# Altium schematic sheet 01-100BASET1_PHY.SchDoc
size A3; SheetNumber: 1; SheetTotal: 2
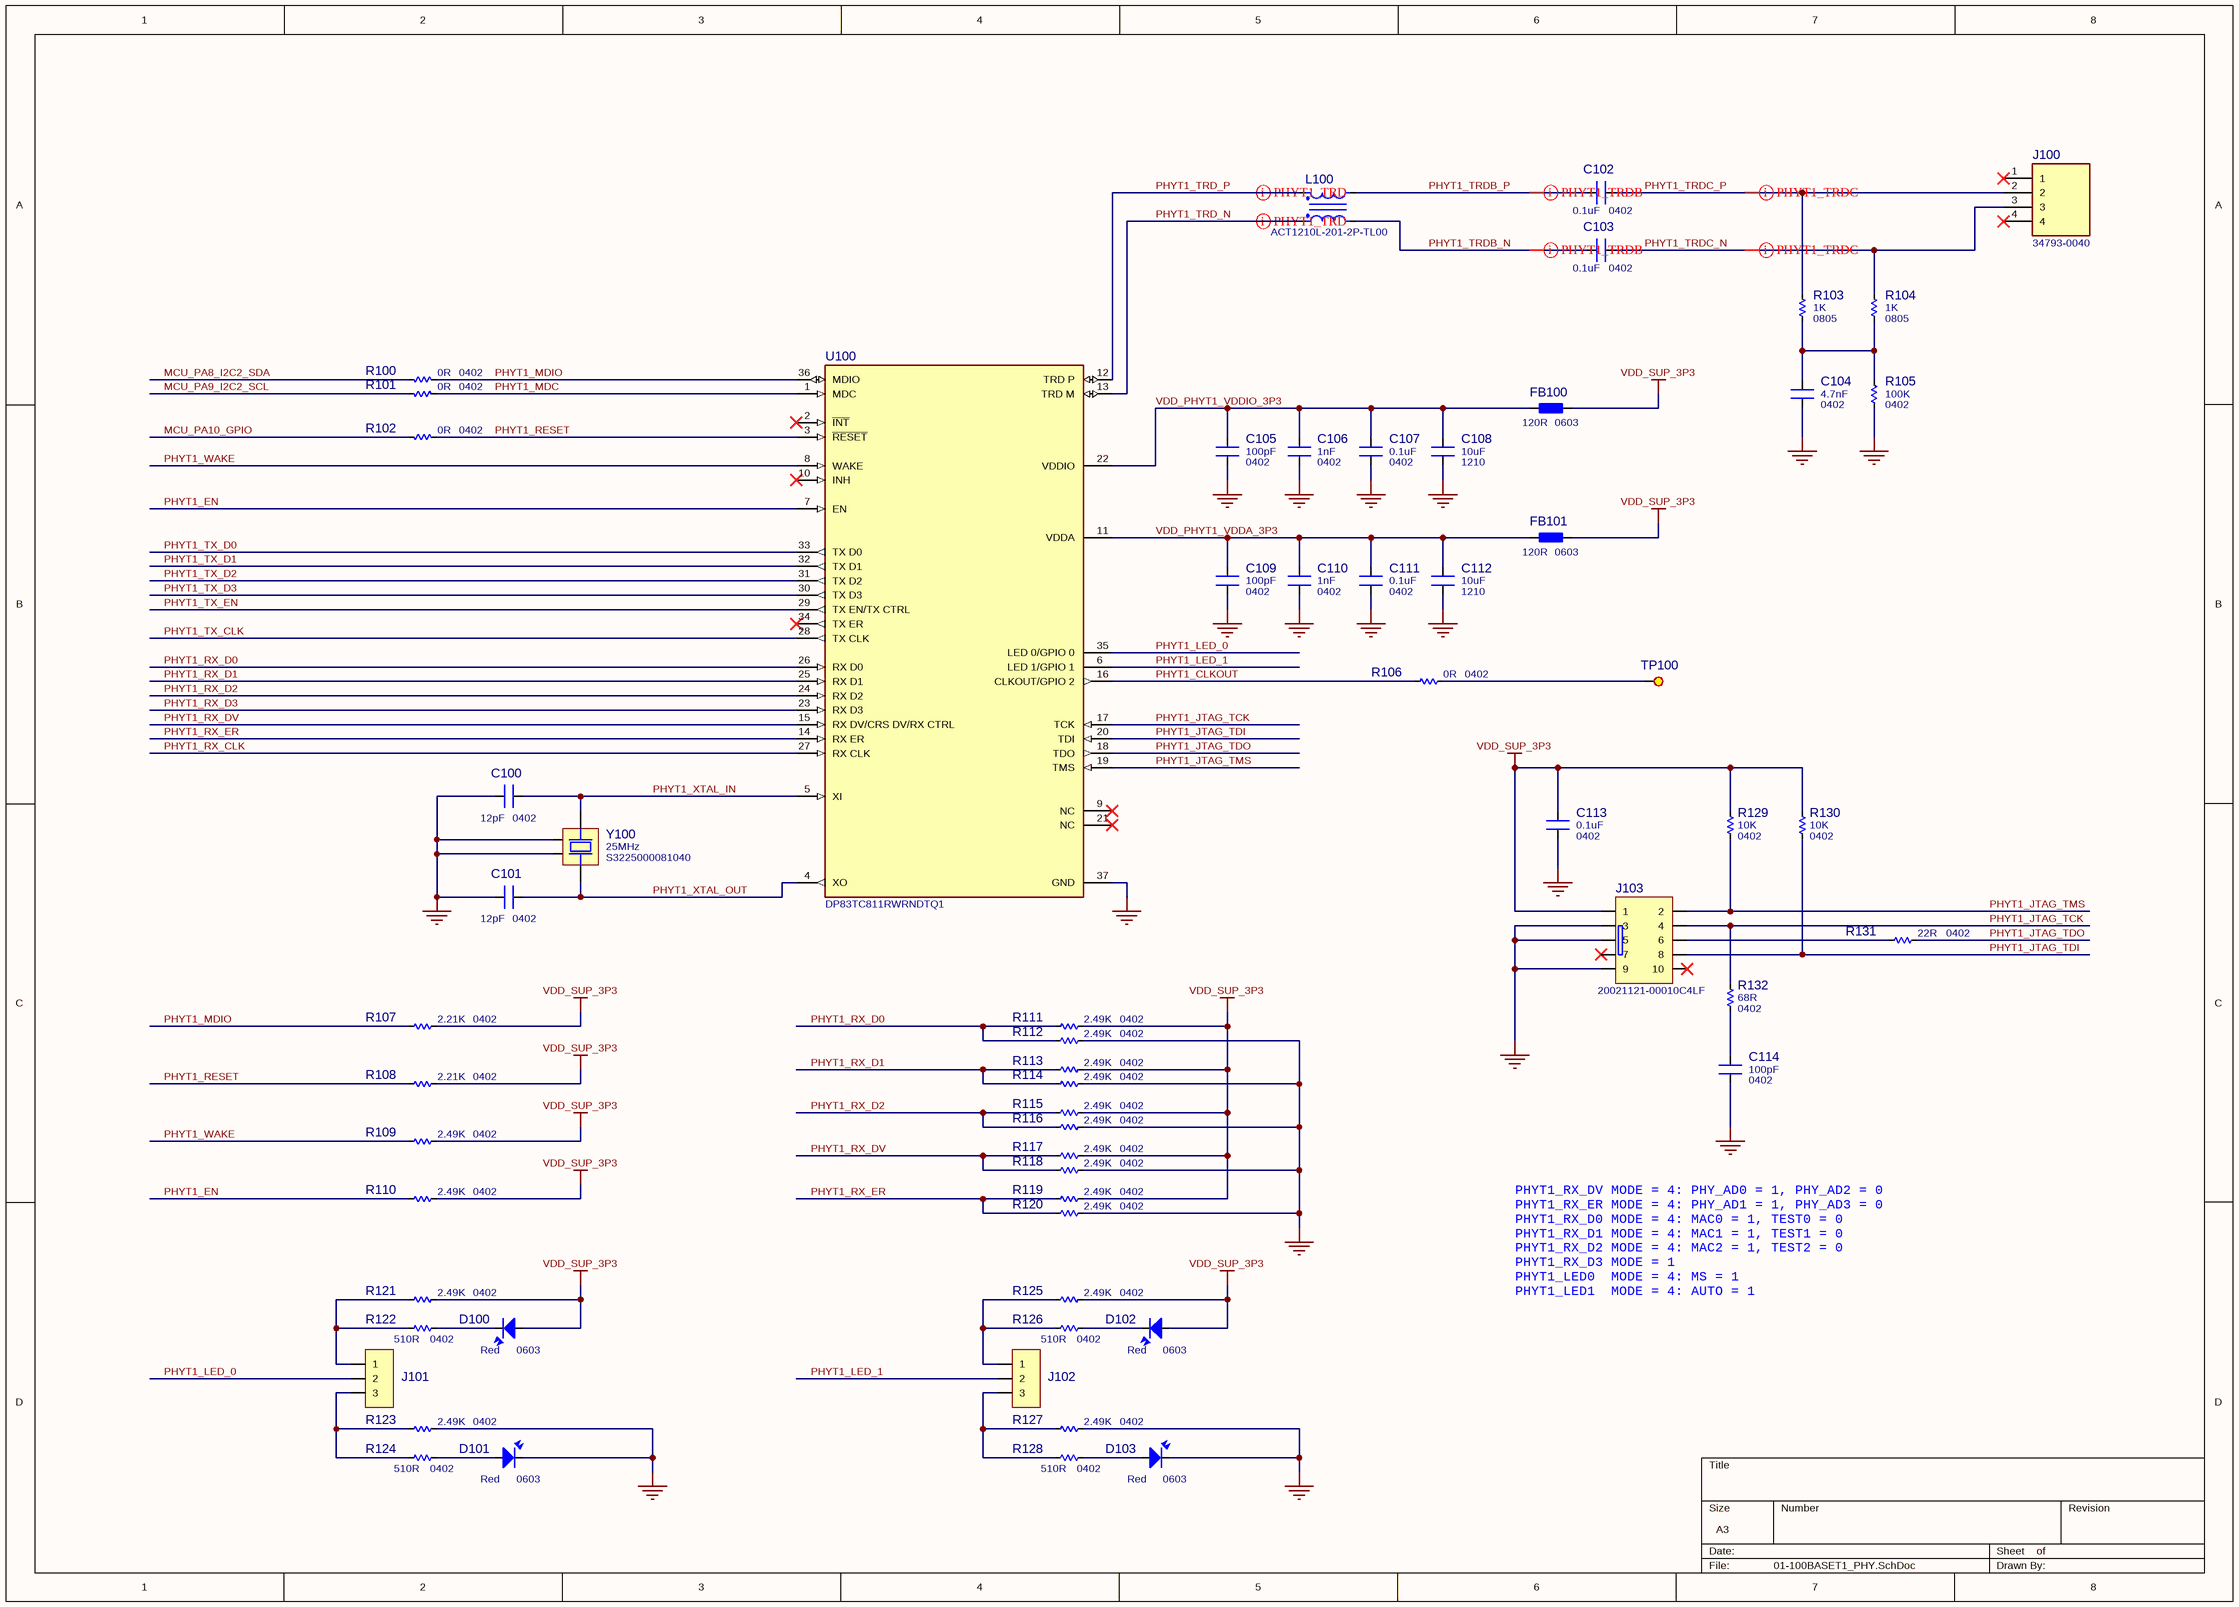
[diagram p0: 01-100BASET1_PHY.SchDoc]

## Parts
C100  value 12pF  Package: 0402  [CAP_C_0402]  (hidden comment: Capacitor NP)
C101  value 12pF  Package: 0402  [CAP_C_0402]  (hidden comment: Capacitor NP)
C102  value 0.1uF  Package: 0402  [CAP_C_0402]  (hidden comment: Capacitor NP)
C103  value 0.1uF  Package: 0402  [CAP_C_0402]  (hidden comment: Capacitor NP)
C104  value 4.7nF  Package: 0402  [CAP_C_0402]  (hidden comment: Capacitor NP)
C105  value 100pF  Package: 0402  [CAP_C_0402]  (hidden comment: Capacitor NP)
C106  value 1nF  Package: 0402  [CAP_C_0402]  (hidden comment: Capacitor NP)
C107  value 0.1uF  Package: 0402  [CAP_C_0402]  (hidden comment: Capacitor NP)
C108  value 10uF  Package: 1210  [CAP_C_1210]  (hidden comment: Capacitor NP)
C109  value 100pF  Package: 0402  [CAP_C_0402]  (hidden comment: Capacitor NP)
C110  value 1nF  Package: 0402  [CAP_C_0402]  (hidden comment: Capacitor NP)
C111  value 0.1uF  Package: 0402  [CAP_C_0402]  (hidden comment: Capacitor NP)
C112  value 10uF  Package: 1210  [CAP_C_1210]  (hidden comment: Capacitor NP)
C113  value 0.1uF  Package: 0402  [CAP_C_0402]  (hidden comment: Capacitor NP)
C114  value 100pF  Package: 0402  [CAP_C_0402]  (hidden comment: Capacitor NP)
D100  Color: Red  Package: 0603  [LED-SMD-0603-RED]  (hidden comment: LED)
D101  Color: Red  Package: 0603  [LED-SMD-0603-RED]  (hidden comment: LED)
D102  Color: Red  Package: 0603  [LED-SMD-0603-RED]  (hidden comment: LED)
D103  Color: Red  Package: 0603  [LED-SMD-0603-RED]  (hidden comment: LED)
FB100  value 120R  Package: 0603  [IND_C_0603]  (hidden comment: Ferrite bead)
FB101  value 120R  Package: 0603  [IND_C_0603]  (hidden comment: Ferrite bead)
J100  34793-0040  [34793-0040]
J101  JP3  [JP3-D1T]  (value not drawn)
J102  JP3  [JP3-D1T]  (value not drawn)
J103  Manufacturer Part Number: 20021121-00010C4LF  [IDE_1.27-SMD-10V_2]  (hidden comment: IDE_10P)
L100  Manufacturer Part Number: ACT1210L-201-2P-TL00  [IND_ACT1210L-2P]  (hidden comment: Choke)
R100  value 0R  Package: 0402  [RES_C_0402]  (hidden comment: Resistor)
R101  value 0R  Package: 0402  [RES_C_0402]  (hidden comment: Resistor)
R102  value 0R  Package: 0402  [RES_C_0402]  (hidden comment: Resistor)
R103  value 1K  Package: 0805  [RES_C_0805]  (hidden comment: Resistor)
R104  value 1K  Package: 0805  [RES_C_0805]  (hidden comment: Resistor)
R105  value 100K  Package: 0402  [RES_C_0402]  (hidden comment: Resistor)
R106  value 0R  Package: 0402  [RES_C_0402]  (hidden comment: Resistor)
R107  value 2.21K  Package: 0402  [RES_C_0402]  (hidden comment: Resistor)
R108  value 2.21K  Package: 0402  [RES_C_0402]  (hidden comment: Resistor)
R109  value 2.49K  Package: 0402  [RES_C_0402]  (hidden comment: Resistor)
R110  value 2.49K  Package: 0402  [RES_C_0402]  (hidden comment: Resistor)
R111  value 2.49K  Package: 0402  [RES_C_0402]  (hidden comment: Resistor)
R112  value 2.49K  Package: 0402  [RES_C_0402]  (hidden comment: Resistor)
R113  value 2.49K  Package: 0402  [RES_C_0402]  (hidden comment: Resistor)
R114  value 2.49K  Package: 0402  [RES_C_0402]  (hidden comment: Resistor)
R115  value 2.49K  Package: 0402  [RES_C_0402]  (hidden comment: Resistor)
R116  value 2.49K  Package: 0402  [RES_C_0402]  (hidden comment: Resistor)
R117  value 2.49K  Package: 0402  [RES_C_0402]  (hidden comment: Resistor)
R118  value 2.49K  Package: 0402  [RES_C_0402]  (hidden comment: Resistor)
R119  value 2.49K  Package: 0402  [RES_C_0402]  (hidden comment: Resistor)
R120  value 2.49K  Package: 0402  [RES_C_0402]  (hidden comment: Resistor)
R121  value 2.49K  Package: 0402  [RES_C_0402]  (hidden comment: Resistor)
R122  value 510R  Package: 0402  [RES_C_0402]  (hidden comment: Resistor)
R123  value 2.49K  Package: 0402  [RES_C_0402]  (hidden comment: Resistor)
R124  value 510R  Package: 0402  [RES_C_0402]  (hidden comment: Resistor)
R125  value 2.49K  Package: 0402  [RES_C_0402]  (hidden comment: Resistor)
R126  value 510R  Package: 0402  [RES_C_0402]  (hidden comment: Resistor)
R127  value 2.49K  Package: 0402  [RES_C_0402]  (hidden comment: Resistor)
R128  value 510R  Package: 0402  [RES_C_0402]  (hidden comment: Resistor)
R129  value 10K  Package: 0402  [RES_C_0402]  (hidden comment: Resistor)
R130  value 10K  Package: 0402  [RES_C_0402]  (hidden comment: Resistor)
R131  value 22R  Package: 0402  [RES_C_0402]  (hidden comment: Resistor)
R132  value 68R  Package: 0402  [RES_C_0402]  (hidden comment: Resistor)
TP100  TestPoint  [TESTPOINT]  (value not drawn)
U100  DP83TC811RWRNDTQ1  [QFN50P600X600X100_HS-37N]
Y100  Manufacturer Part Number: S3225000081040  Frequency: 25MHz  [XT-SMD-3225-4P]  (hidden comment: Crystal)

## Nets
GND: C100.2 C101.2 C104.2 C105.1 C106.1 C107.1 C108.1 C109.1 C110.1 C111.1 C112.1 C113.1 C114.2 D101.2 D103.2 J103.3 J103.5 J103.9 R105.2 R112.2 R114.2 R116.2 R118.2 R120.2 R123.2 R127.2 U100.37(GND) Y100.2 Y100.4
VDD_SUP_3P3: C113.2 D100.1 D102.1 FB100.1 FB101.1 J103.1 R107.2 R108.2 R109.2 R110.2 R111.2 R113.2 R115.2 R117.2 R119.2 R121.2 R125.2 R129.1 R130.1
MCU_PA8_I2C2_SDA: R100.2
MCU_PA9_I2C2_SCL: R101.2
MCU_PA10_GPIO: R102.2
PHYT1_CLKOUT: R106.2 U100.16(CLKOUT/GPIO_2)
PHYT1_EN: R110.1 U100.7(EN)
PHYT1_JTAG_TCK: J103.4 R132.1 U100.17(TCK)
PHYT1_JTAG_TDI: J103.8 R130.2 U100.20(TDI)
PHYT1_JTAG_TDO: R131.1 U100.18(TDO)
PHYT1_JTAG_TMS: J103.2 R129.2 U100.19(TMS)
PHYT1_LED_0: J101.2 U100.35(LED_0/GPIO_0)
PHYT1_LED_1: J102.2 U100.6(LED_1/GPIO_1)
PHYT1_MDC: R101.1 U100.1(MDC)
PHYT1_MDIO: R100.1 R107.1 U100.36(MDIO)
PHYT1_RESET: R102.1 R108.1 U100.3(~{RESET})
PHYT1_RX_CLK: U100.27(RX_CLK)
PHYT1_RX_D0: R111.1 R112.1 U100.26(RX_D0)
PHYT1_RX_D1: R113.1 R114.1 U100.25(RX_D1)
PHYT1_RX_D2: R115.1 R116.1 U100.24(RX_D2)
PHYT1_RX_D3: U100.23(RX_D3)
PHYT1_RX_DV: R117.1 R118.1 U100.15(RX_DV/CRS_DV/RX_CTRL)
PHYT1_RX_ER: R119.1 R120.1 U100.14(RX_ER)
PHYT1_TRD_N: L100.1 U100.13(TRD_M)
PHYT1_TRD_P: L100.2 U100.12(TRD_P)
PHYT1_TRDB_N: C103.2 L100.4
PHYT1_TRDB_P: C102.2 L100.3
PHYT1_TRDC_N: C103.1 J100.3 R104.2
PHYT1_TRDC_P: C102.1 J100.2 R103.2
PHYT1_TX_CLK: U100.28(TX_CLK)
PHYT1_TX_D0: U100.33(TX_D0)
PHYT1_TX_D1: U100.32(TX_D1)
PHYT1_TX_D2: U100.31(TX_D2)
PHYT1_TX_D3: U100.30(TX_D3)
PHYT1_TX_EN: U100.29(TX_EN/TX_CTRL)
PHYT1_WAKE: R109.1 U100.8(WAKE)
PHYT1_XTAL_IN: C100.1 U100.5(XI) Y100.1
PHYT1_XTAL_OUT: C101.1 U100.4(XO) Y100.3
VDD_PHYT1_VDDA_3P3: C109.2 C110.2 C111.2 C112.2 FB101.2 U100.11(VDDA)
VDD_PHYT1_VDDIO_3P3: C105.2 C106.2 C107.2 C108.2 FB100.2 U100.22(VDDIO)
NetC104_1: C104.1 R103.1 R104.1 R105.1
NetC114_1: C114.1 R132.2
NetD100_2: D100.2 R122.2
NetD101_1: D101.1 R124.2
NetD102_2: D102.2 R126.2
NetD103_1: D103.1 R128.2
NetJ101_1: J101.1 R121.1 R122.1
NetJ101_3: J101.3 R123.1 R124.1
NetJ102_1: J102.1 R125.1 R126.1
NetJ102_3: J102.3 R127.1 R128.1
NetJ103_6: J103.6 R131.2
NetR106_1: R106.1 TP100.0

Not connected (* = marked no-connect by the designer): J100 1* 4*; J103 7* 10*; U100 2(~{INT})* 9(NC)* 10(INH)* 21(NC)* 34(TX_ER)*

## Layout directives
differential pair; net class NC_DIFFPAIR_100R_ETH; differential pair class DIFFPAIR_100R_ETH: PHYT1_TRD_N, PHYT1_TRD_P, PHYT1_TRDB_N, PHYT1_TRDB_P, PHYT1_TRDC_N, PHYT1_TRDC_P

## Notes on the sheet
- PHYT1_RX_DV MODE = 4: PHY_AD0 = 1, PHY_AD2 = 0
- PHYT1_RX_ER MODE = 4: PHY_AD1 = 1, PHY_AD3 = 0
- PHYT1_RX_D0 MODE = 4: MAC0 = 1, TEST0 = 0
- PHYT1_RX_D1 MODE = 4: MAC1 = 1, TEST1 = 0
- PHYT1_RX_D2 MODE = 4: MAC2 = 1, TEST2 = 0
- PHYT1_RX_D3 MODE = 1
- PHYT1_LED0  MODE = 4: MS = 1
- PHYT1_LED1  MODE = 4: AUTO = 1

## Library data of the parts
C100 C101 = Cap: Ceramic Capacitor SMD 0402 12pF ±5% 50V; Manufacturer: FH(Guangdong Fenghua Advanced Tech); Manufacturer Part Number: 0402CG120J500NT; Temperature Coeffcient: -55 to 85℃; Revision: 0; Tolerance: ±5%; ComponentLink1URL: https://datasheet.lcsc.com/lcsc/1810111610_FH-Guangdong-Fenghua-Advanced-Tech-0402CG150J500NT_C1548.pdf; ComponentLink1Description: SVN Datasheet; ComponentLink2URL: *; ComponentLink2Description: Local Datasheet; ComponentLink3URL: D:\Altium\Library\AS50 library\AS50.SchLib; ComponentLink3Description: Open Symbol; ComponentLink4URL: D:\Altium\Library\AS50 library\Capacitors.PcbLib; ComponentLink4Description: Open Footprint; ComponentLink5Description: Open Footprint 2; ComponentLink6Description: Open Footprint 3; ComponentLink7Description: Open Footprint 4; Category: Capacitor; Voltage: 50V; Supplier 1: LCSC; Supplier Part Number 1: C1547
C102 C103 C107 C111 C113 = Cap: Ceramic Capacitor SMD 0402 100nF ±10% 16V; Manufacturer: Samsung; Manufacturer Part Number: CL05B104KO5NNNC; Temperature Coeffcient: -55 to 85℃; Revision: 0; Tolerance: ±10%; ComponentLink1URL: http://product.samsungsem.com/mlcc/CL05B104KO5NNN.do; ComponentLink1Description: SVN Datasheet; ComponentLink2URL: *; ComponentLink2Description: Local Datasheet; ComponentLink3URL: D:\Altium\Library\AS50 library\AS50.SchLib; ComponentLink3Description: Open Symbol; ComponentLink4URL: D:\Altium\Library\AS50 library\Capacitors.PcbLib; ComponentLink4Description: Open Footprint; ComponentLink5Description: Open Footprint 2; ComponentLink6Description: Open Footprint 3; ComponentLink7Description: Open Footprint 4; Category: Capacitor; Voltage: 16V; Supplier 1: LCSC; Supplier Part Number 1: C1525
C104 = Cap: Ceramic Capacitor SMD 0402 4.7nF ±10% 50V; Manufacturer: FH(Guangdong Fenghua Advanced Tech); Manufacturer Part Number: 0402B472K500NT; Temperature Coeffcient: -55 to 85℃; Revision: 0; Tolerance: ±10%; ComponentLink1URL: https://datasheet.lcsc.com/lcsc/1811031110_FH-Guangdong-Fenghua-Advanced-Tech-0402B472K500NT_C1538.pdf; ComponentLink1Description: SVN Datasheet; ComponentLink2URL: *; ComponentLink2Description: Local Datasheet; ComponentLink3URL: D:\Altium\Library\AS50 library\AS50.SchLib; ComponentLink3Description: Open Symbol; ComponentLink4URL: D:\Altium\Library\AS50 library\Capacitors.PcbLib; ComponentLink4Description: Open Footprint; ComponentLink5Description: Open Footprint 2; ComponentLink6Description: Open Footprint 3; ComponentLink7Description: Open Footprint 4; Category: Capacitor; Voltage: 50V; Supplier 1: LCSC; Supplier Part Number 1: C1538
C105 C109 = Cap: Ceramic Capacitor SMD 0402 100pF ±5% 50V; Manufacturer: Samsung; Manufacturer Part Number: CL05C101JB5NNNC; Temperature Coeffcient: -55 to 85℃; Revision: 0; Tolerance: ±5%; ComponentLink1URL: http://product.samsungsem.com/mlcc/CL05B224KO5NNN.do; ComponentLink1Description: SVN Datasheet; ComponentLink2URL: *; ComponentLink2Description: Local Datasheet; ComponentLink3URL: D:\Altium\Library\AS50 library\AS50.SchLib; ComponentLink3Description: Open Symbol; ComponentLink4URL: D:\Altium\Library\AS50 library\Capacitors.PcbLib; ComponentLink4Description: Open Footprint; ComponentLink5Description: Open Footprint 2; ComponentLink6Description: Open Footprint 3; ComponentLink7Description: Open Footprint 4; Category: Capacitor; Voltage: 50V; Supplier 1: LCSC; Supplier Part Number 1: C26409
C106 C110 = Cap: Ceramic Capacitor SMD 0402 1nF ±10% 50V; Manufacturer: Samsung; Manufacturer Part Number: CL05B102KB5NNNC; Temperature Coeffcient: -55 to 85℃; Revision: 0; Tolerance: ±10%; ComponentLink1URL: http://product.samsungsem.com/mlcc/CL05B224KO5NNN.do; ComponentLink1Description: SVN Datasheet; ComponentLink2URL: *; ComponentLink2Description: Local Datasheet; ComponentLink3URL: D:\Altium\Library\AS50 library\AS50.SchLib; ComponentLink3Description: Open Symbol; ComponentLink4URL: D:\Altium\Library\AS50 library\Capacitors.PcbLib; ComponentLink4Description: Open Footprint; ComponentLink5Description: Open Footprint 2; ComponentLink6Description: Open Footprint 3; ComponentLink7Description: Open Footprint 4; Category: Capacitor; Voltage: 50V; Supplier 1: LCSC; Supplier Part Number 1: C14442
C108 C112 = Cap: Ceramic Capacitor SMD 1210 10uF ±10% 25V; Manufacturer: Samsung; Manufacturer Part Number: CL32B106KAJNNNE; Temperature Coeffcient: -55 to 85℃; Revision: 0; Tolerance: ±10%; ComponentLink1URL: http://product.samsungsem.com/mlcc/CL05A105KA5NQN.do; ComponentLink1Description: SVN Datasheet; ComponentLink2URL: *; ComponentLink2Description: Local Datasheet; ComponentLink3URL: D:\Altium\Library\AS50 library\AS50.SchLib; ComponentLink3Description: Open Symbol; ComponentLink4URL: D:\Altium\Library\AS50 library\Capacitors.PcbLib; ComponentLink4Description: Open Footprint; ComponentLink5Description: Open Footprint 2; ComponentLink6Description: Open Footprint 3; ComponentLink7Description: Open Footprint 4; Category: Capacitor; Voltage: 25V; Supplier 1: LCSC; Supplier Part Number 1: C39232
C114 = Cap: Ceramic Capacitor SMD 0402 100pF ±5% 50V; Manufacturer: FH(Guangdong Fenghua Advanced Tech); Manufacturer Part Number: 0402CG101J500NT; Temperature Coeffcient: -55 to 85℃; Revision: 0; Tolerance: ±5%; ComponentLink1URL: https://datasheet.lcsc.com/lcsc/1810111610_FH-Guangdong-Fenghua-Advanced-Tech-0402CG150J500NT_C1548.pdf; ComponentLink1Description: SVN Datasheet; ComponentLink2URL: *; ComponentLink2Description: Local Datasheet; ComponentLink3URL: D:\Altium\Library\AS50 library\AS50.SchLib; ComponentLink3Description: Open Symbol; ComponentLink4URL: D:\Altium\Library\AS50 library\Capacitors.PcbLib; ComponentLink4Description: Open Footprint; ComponentLink5Description: Open Footprint 2; ComponentLink6Description: Open Footprint 3; ComponentLink7Description: Open Footprint 4; Category: Capacitor; Voltage: 50V; Supplier 1: LCSC; Supplier Part Number 1: C1546
D100-D103 = LED: Red 615~630nm 1.9~2.2V 0603 Light Emitting Diodes (LED) RoHS; Manufacturer: Hubei KENTO Elec; Manufacturer Part Number: KT-0603R; Category: LEDs; ComponentLink1URL: http://www.led-kento.com/smd-led/0603-smd-led/0603-smd-led-emitting-color-red.html; ComponentLink1Description: SVD Datasheet; ComponentLink2URL: *; ComponentLink2Description: Local Datasheet; ComponentLink3URL: D:\Altium\Library\AS50 library\AS50.SchLib; ComponentLink3Description: Open Symbol; ComponentLink4URL: D:\Altium\Library\AS50 library\LED.PcbLib; ComponentLink4Description: Open Footprint; Supplier 1: LCSC; Supplier Part Number 1: C2286
FB100 FB101 = Ferrite bead: Ferrite bead SMD 0603 120Ω ±25% @ 100MHz DCR=0.03Ω 3A; Manufacturer: Murata Electronics; Manufacturer Part Number: BLM18KG121TH1D; Category: Ferrite Bead; Tolerance: 25%; Frequency: 100MHz; DC Current: 3A; ComponentLink1URL: https://www.sunlordinc.com/Download.aspx?file=L1VwbG9hZEZpbGVzL1BERl9DYXQvMjAyMTA5MDcxNDU1NTM2OC5wZGY=&lan=en; ComponentLink1Description: SVN Datasheet; ComponentLink2URL: *; ComponentLink2Description: Local Datasheet; ComponentLink3URL: D:\Altium\Library\AS50 library\AS50.SchLib; ComponentLink3Description: Open Symbol; ComponentLink4URL: D:\Altium\Library\AS50 library\Inductors.PcbLib; ComponentLink4Description: Open Footprint; Supplier 1: LCSC; Supplier Part Number 1: C437404
J100 = 34793-0040: Automotive Connectors 4P 1R MINI50 HEADER R/A UNSEALED BLACK; Manufacturer: Molex; Supplier Part Number 1: WM9385-ND; Supplier 1: Digikey; Manufacturer Part Number: 34793-0040; Category: Connectors
J101 J102 = JP3: Single 3-pin jumper
J103 = IDE_10P: Conn Unshrouded Header HDR 10 POS 1.27mm Solder ST Top Entry SMD Tube; Manufacturer: Amphenol ICC; Category: Headers; ComponentLink1URL: https://cdn.amphenol-cs.com/media/wysiwyg/files/drawing/20021121.pdf; ComponentLink1Description: SVN Datasheet; ComponentLink2URL: *; ComponentLink2Description: Local Datasheet; ComponentLink3URL: D:\Altium\Library\AS50 library\AS50.SchLib; ComponentLink3Description: Open Symbol; ComponentLink4URL: D:\Altium\Library\AS50 library\Terminals.PcbLib; ComponentLink4Description: Open Footprint; Supplier 1: LCSC; Supplier Part Number 1: C150517
L100 = Choke: 200 µH @ 100 kHz 2 Line Common Mode Choke Surface Mount 70mA DCR 5.5Ohm; Manufacturer: TDK; Category: Inductors; ComponentLink1URL: https://product.tdk.com/en/system/files?file=dam/doc/product/emc/emc/cmf_cmc/catalog/cmf_automotive_signal_act1210l-201_en.pdf; ComponentLink1Description: SVD Datasheet; ComponentLink2URL: *; ComponentLink2Description: Local Datasheet; ComponentLink3URL: D:\Altium\Library\AS50 library\AS50.SchLib; ComponentLink3Description: Open Symbol; ComponentLink4URL: D:\Altium\Library\AS50 library\Inductors.PcbLib; ComponentLink4Description: Open Footprint; Supplier 1: Digi-Key; Supplier Part Number 1: 445-174934-1-ND
R100-R102 R106 = Res: Resistor SMD 0402 0R ±1% 1/16W; Manufacturer: UNI-ROYAL(Uniroyal Elec); Manufacturer Part Number: 0402WGF0000TCE; Voltage: 50V; Temperature Coeffcient: ±100ppm/C; Tolerance: ±1%; Revision: 0; ComponentLink1URL: http://uni-royal.cn/images/userfile/file/1590821906c56505e6d9ab55c7.pdf; ComponentLink1Description: SVN Datasheet; ComponentLink2URL: *; ComponentLink2Description: Local Datasheet; ComponentLink3URL: D:\Altium\Library\AS50 library\AS50.SchLib; ComponentLink3Description: Open Symbol; ComponentLink4URL: D:\Altium\Library\AS50 library\Resistors.PcbLib; ComponentLink4Description: Open Footprint; ComponentLink5Description: Open Footprint 2; ComponentLink6Description: Open Footprint 3; ComponentLink7Description: Open Footprint 4; Operating Temperature: -55C to +155C; Category: Resistor; Power: 1/16W; Supplier 1: LCSC; Supplier Part Number 1: C17168
R103 R104 = Res: Resistor SMD 0805 1K ±1% 1/8W; Manufacturer: UNI-ROYAL(Uniroyal Elec); Manufacturer Part Number: 0805W8F1001T5E; Voltage: 50V; Temperature Coeffcient: ±100ppm/C; Tolerance: ±1%; Revision: 0; ComponentLink1URL: http://uni-royal.cn/images/userfile/file/1590821906c56505e6d9ab55c7.pdf; ComponentLink1Description: SVN Datasheet; ComponentLink2URL: *; ComponentLink2Description: Local Datasheet; ComponentLink3URL: D:\Altium\Library\AS50 library\AS50.SchLib; ComponentLink3Description: Open Symbol; ComponentLink4URL: D:\Altium\Library\AS50 library\Resistors.PcbLib; ComponentLink4Description: Open Footprint; ComponentLink5Description: Open Footprint 2; ComponentLink6Description: Open Footprint 3; ComponentLink7Description: Open Footprint 4; Operating Temperature: -55C to +155C; Category: Resistor; Power: 1/8W; Supplier 1: LCSC; Supplier Part Number 1: C17513
R105 = Res: Resistor SMD 0402 100K ±1% 1/16W; Manufacturer: UNI-ROYAL(Uniroyal Elec); Manufacturer Part Number: 0402WGF1003TCE; Voltage: 50V; Temperature Coeffcient: ±100ppm/C; Tolerance: ±1%; Revision: 0; ComponentLink1URL: http://uni-royal.cn/images/userfile/file/1590821906c56505e6d9ab55c7.pdf; ComponentLink1Description: SVN Datasheet; ComponentLink2URL: *; ComponentLink2Description: Local Datasheet; ComponentLink3URL: D:\Altium\Library\AS50 library\AS50.SchLib; ComponentLink3Description: Open Symbol; ComponentLink4URL: D:\Altium\Library\AS50 library\Resistors.PcbLib; ComponentLink4Description: Open Footprint; ComponentLink5Description: Open Footprint 2; ComponentLink6Description: Open Footprint 3; ComponentLink7Description: Open Footprint 4; Operating Temperature: -55C to +155C; Category: Resistor; Power: 1/16W; Supplier 1: LCSC; Supplier Part Number 1: C25741
R107 R108 = Res: Resistor SMD 0402 2.21K ±1% 1/16W; Manufacturer: UNI-ROYAL(Uniroyal Elec); Manufacturer Part Number: 0402WGF2211TCE; Voltage: 50V; Temperature Coeffcient: ±100ppm/C; Tolerance: ±1%; Revision: 0; ComponentLink1URL: http://uni-royal.cn/images/userfile/file/1590821906c56505e6d9ab55c7.pdf; ComponentLink1Description: SVN Datasheet; ComponentLink2URL: *; ComponentLink2Description: Local Datasheet; ComponentLink3URL: D:\Altium\Library\AS50 library\AS50.SchLib; ComponentLink3Description: Open Symbol; ComponentLink4URL: D:\Altium\Library\AS50 library\Resistors.PcbLib; ComponentLink4Description: Open Footprint; ComponentLink5Description: Open Footprint 2; ComponentLink6Description: Open Footprint 3; ComponentLink7Description: Open Footprint 4; Operating Temperature: -55C to +155C; Category: Resistor; Power: 1/16W; Supplier 1: LCSC; Supplier Part Number 1: C25880
R109-R121 R123 R125 R127 = Res: Resistor SMD 0402 2.49K ±1% 1/16W; Manufacturer: UNI-ROYAL(Uniroyal Elec); Manufacturer Part Number: 0402WGF2491TCE; Voltage: 50V; Temperature Coeffcient: ±100ppm/C; Tolerance: ±1%; Revision: 0; ComponentLink1URL: http://uni-royal.cn/images/userfile/file/1590821906c56505e6d9ab55c7.pdf; ComponentLink1Description: SVN Datasheet; ComponentLink2URL: *; ComponentLink2Description: Local Datasheet; ComponentLink3URL: D:\Altium\Library\AS50 library\AS50.SchLib; ComponentLink3Description: Open Symbol; ComponentLink4URL: D:\Altium\Library\AS50 library\Resistors.PcbLib; ComponentLink4Description: Open Footprint; ComponentLink5Description: Open Footprint 2; ComponentLink6Description: Open Footprint 3; ComponentLink7Description: Open Footprint 4; Operating Temperature: -55C to +155C; Category: Resistor; Power: 1/16W; Supplier 1: LCSC; Supplier Part Number 1: C25884
R122 R124 R126 R128 = Res: Resistor SMD 0402 510R ±1% 1/16W; Manufacturer: Yageo; Manufacturer Part Number: RC0402JR-07510RL; Voltage: 50V; Temperature Coeffcient: ±100ppm/C; Tolerance: ±1%; Revision: 0; ComponentLink1URL: https://www.yageo.com/upload/media/product/products/datasheet/rchip/PYu-RC_Group_51_RoHS_L_12.pdf; ComponentLink1Description: SVN Datasheet; ComponentLink2URL: *; ComponentLink2Description: Local Datasheet; ComponentLink3URL: D:\Altium\Library\AS50 library\AS50.SchLib; ComponentLink3Description: Open Symbol; ComponentLink4URL: D:\Altium\Library\AS50 library\Resistors.PcbLib; ComponentLink4Description: Open Footprint; ComponentLink5Description: Open Footprint 2; ComponentLink6Description: Open Footprint 3; ComponentLink7Description: Open Footprint 4; Operating Temperature: -55C to +155C; Category: Resistor; Power: 1/16W; Supplier 1: LCSC; Supplier Part Number 1: C137860
R129 R130 = Res: Resistor SMD 0402 10K ±1% 1/16W; Manufacturer: UNI-ROYAL(Uniroyal Elec); Manufacturer Part Number: 0402WGF1002TCE; Voltage: 50V; Temperature Coeffcient: ±100ppm/C; Tolerance: ±1%; Revision: 0; ComponentLink1URL: http://uni-royal.cn/images/userfile/file/1590821906c56505e6d9ab55c7.pdf; ComponentLink1Description: SVN Datasheet; ComponentLink2URL: *; ComponentLink2Description: Local Datasheet; ComponentLink3URL: D:\Altium\Library\AS50 library\AS50.SchLib; ComponentLink3Description: Open Symbol; ComponentLink4URL: D:\Altium\Library\AS50 library\Resistors.PcbLib; ComponentLink4Description: Open Footprint; ComponentLink5Description: Open Footprint 2; ComponentLink6Description: Open Footprint 3; ComponentLink7Description: Open Footprint 4; Operating Temperature: -55C to +155C; Category: Resistor; Power: 1/16W; Supplier 1: LCSC; Supplier Part Number 1: C25744
R131 = Res: Resistor SMD 0402 22R ±1% 1/16W; Manufacturer: UNI-ROYAL(Uniroyal Elec); Manufacturer Part Number: 0402WGF220JTCE; Voltage: 50V; Temperature Coeffcient: ±100ppm/C; Tolerance: ±1%; Revision: 0; ComponentLink1URL: http://uni-royal.cn/images/userfile/file/1590821906c56505e6d9ab55c7.pdf; ComponentLink1Description: SVN Datasheet; ComponentLink2URL: *; ComponentLink2Description: Local Datasheet; ComponentLink3URL: D:\Altium\Library\AS50 library\AS50.SchLib; ComponentLink3Description: Open Symbol; ComponentLink4URL: D:\Altium\Library\AS50 library\Resistors.PcbLib; ComponentLink4Description: Open Footprint; ComponentLink5Description: Open Footprint 2; ComponentLink6Description: Open Footprint 3; ComponentLink7Description: Open Footprint 4; Operating Temperature: -55C to +155C; Category: Resistor; Power: 1/16W; Supplier 1: LCSC; Supplier Part Number 1: C25092
R132 = Res: Resistor SMD 0402 68R ±1% 1/16W; Manufacturer: UNI-ROYAL(Uniroyal Elec); Manufacturer Part Number: 0402WGF680JTCE; Voltage: 50V; Temperature Coeffcient: ±100ppm/C; Tolerance: ±1%; Revision: 0; ComponentLink1URL: http://uni-royal.cn/images/userfile/file/1590821906c56505e6d9ab55c7.pdf; ComponentLink1Description: SVN Datasheet; ComponentLink2URL: *; ComponentLink2Description: Local Datasheet; ComponentLink3URL: D:\Altium\Library\AS50 library\AS50.SchLib; ComponentLink3Description: Open Symbol; ComponentLink4URL: D:\Altium\Library\AS50 library\Resistors.PcbLib; ComponentLink4Description: Open Footprint; ComponentLink5Description: Open Footprint 2; ComponentLink6Description: Open Footprint 3; ComponentLink7Description: Open Footprint 4; Operating Temperature: -55C to +155C; Category: Resistor; Power: 1/16W; Supplier 1: LCSC; Supplier Part Number 1: C25131
TP100 = TestPoint: Test Point
U100 = DP83TC811RWRNDTQ1: Texas Instrument Low Power Automotive PHY / 100BASE-T1 Automotive Ethernet Physical Layer Transceiver VQFN-36; Manufacturer: Texas Instruments; Category: ICs; Manufacturer Part Number: DP83TC811RWRNDTQ1; Supplier 1: Mouser; Supplier Part Number 1: 595-DP83TC811RWRNDTQ; ComponentLink1Description: SVD Datasheet; ComponentLink1URL: https://www.ti.com/lit/ds/symlink/dp83tc811r-q1.pdf; ComponentLink2Description: Local Datasheet; ComponentLink2URL: *; ComponentLink3Description: Open Symbol; ComponentLink3URL: D:\Altium\Library\AS50 library\AS50.SchLib; ComponentLink4Description: Open Footprint; ComponentLink4URL: D:\Altium\Library\AS50 library\IC.PcbLib
Y100 = CX3225SB12000H0PSTC1: 25MHz SMD Crystal Resonator 8pF 40Ω ±10ppm -40℃~+85℃ SMD3225-4P; Manufacturer: JGHC; Supplier 1: LCSC; Category: Crystals; ComponentLink1URL: https://www.yxcxtal.com/u_file/photo/20200311/YSX321SL-Datasheet.pdf; ComponentLink1Description: SVD Datasheet; ComponentLink2URL: *; ComponentLink2Description: Local Datasheet; Supplier Part Number 1: C479202; ComponentLink3Description: Open Symbol; ComponentLink3URL: D:\Altium\Library\AS50 library\AS50.SchLib; ComponentLink4Description: Open Footprint; ComponentLink4URL: D:\Altium\Library\AS50 library\Crystals.PcbLib